# Altium schematic sheet MCU.SchDoc
size B
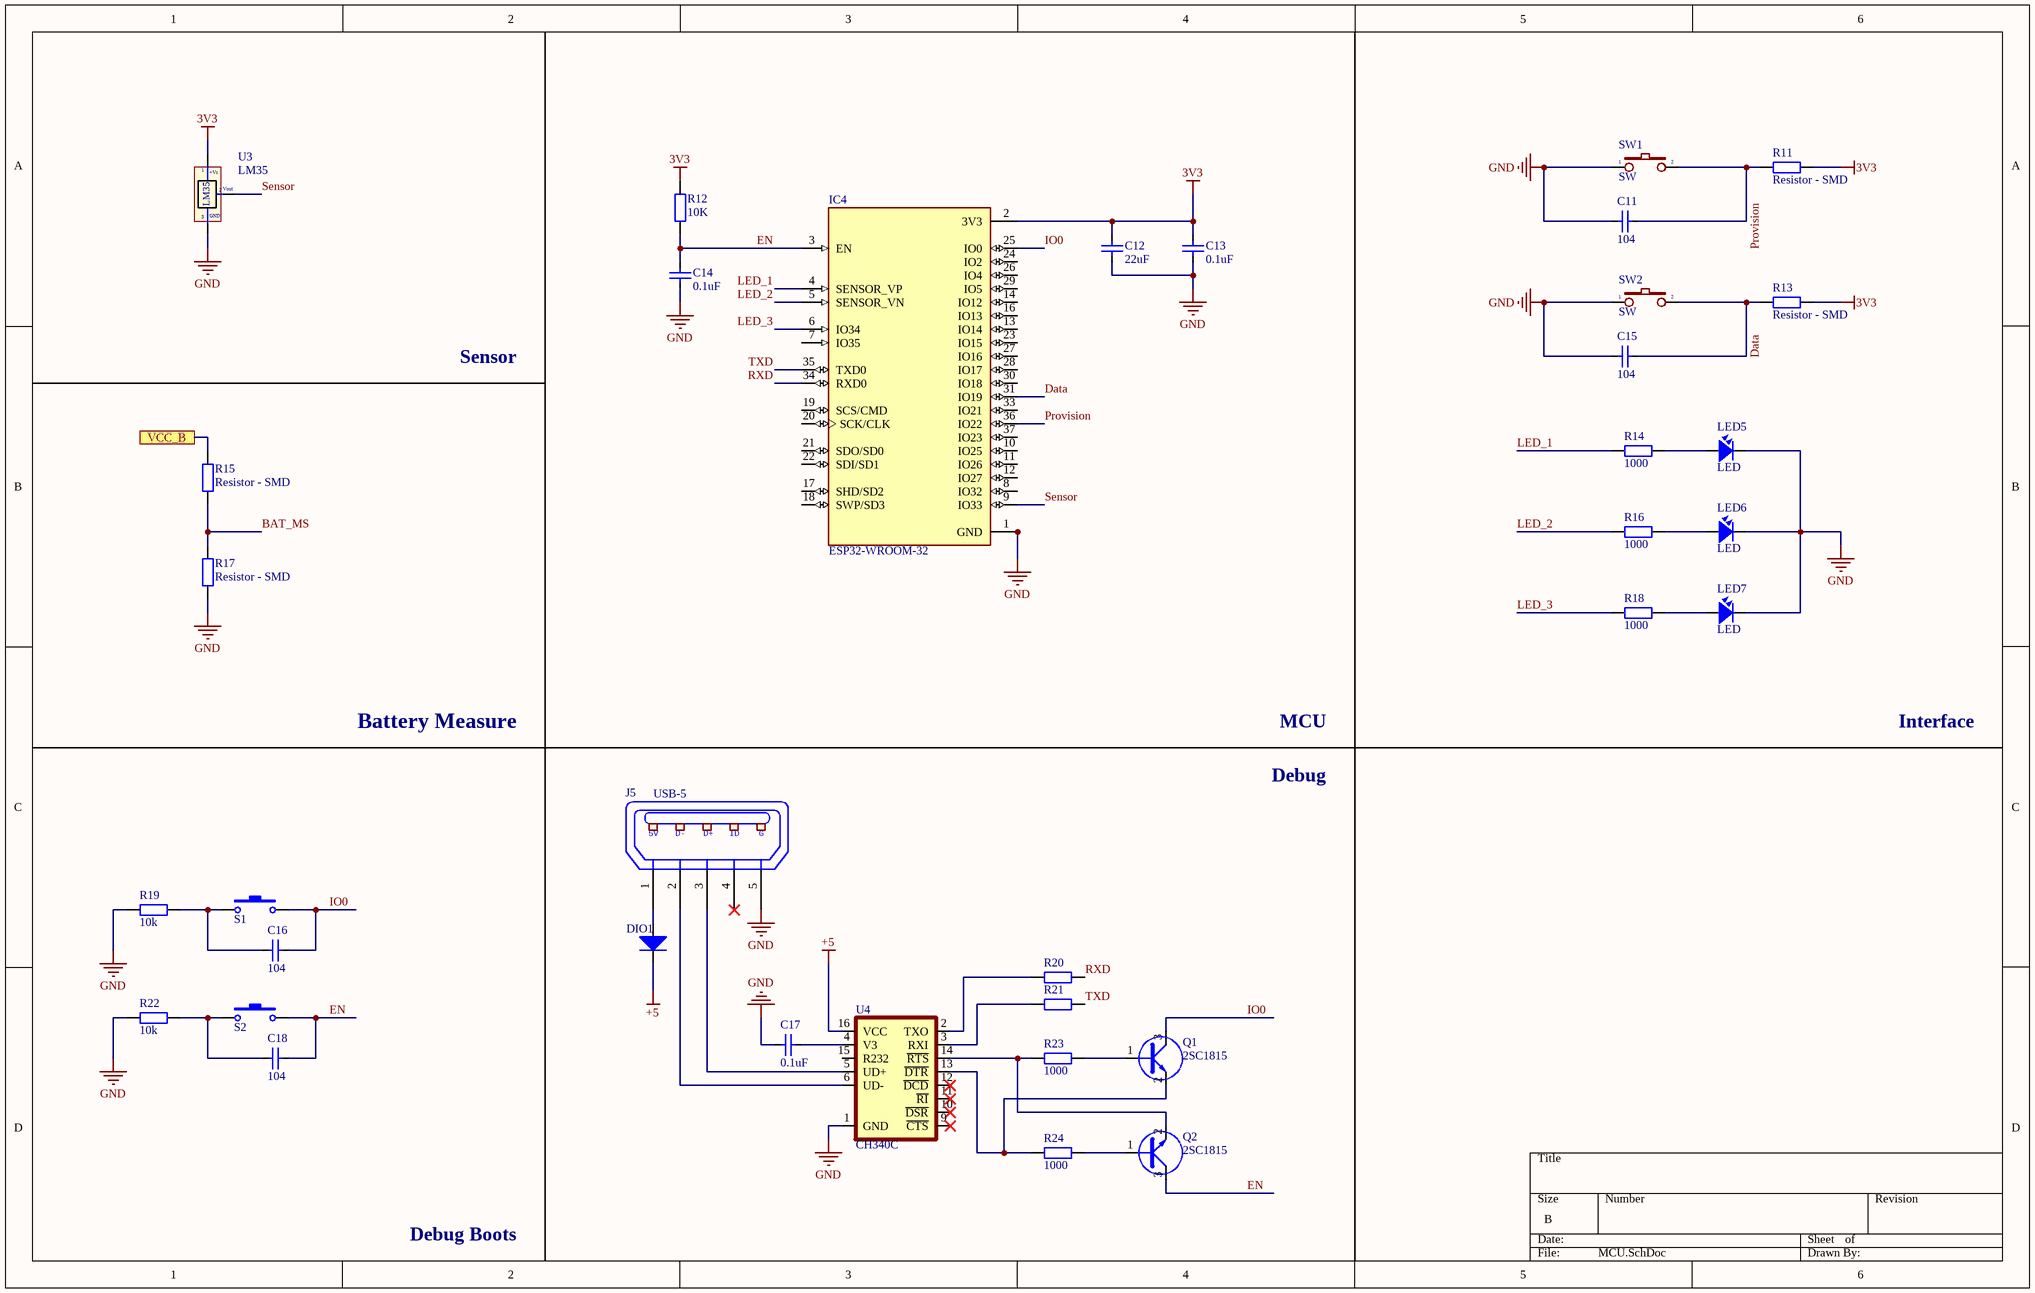
[diagram p0: MCU.SchDoc]

## Parts
C11  104  [CAP_0805]
C12  22uF  [CAP_0805]
C13  0.1uF  [CAP_0805]
C14  0.1uF  [CAP_0805]
C15  104  [CAP_0805]
C16  104  [CAP_0805]
C17  0.1uF  [CAP_0805]
C18  104  [CAP_0805]
DIO1  Diode SMD  [DIO-214AC(SMA)]  (value not drawn)
IC4  ESP32-WROOM-32  [MODULE_ESP32-WROOM-32]
J5  USB-5  [USB-M1]
LED5  LED  [LED-0805-Red]
LED6  LED  [LED-0805-Red]
LED7  LED  [LED-0805-Red]
Q1  2SC1815  [SOT23D]
Q2  2SC1815  [SOT23D]
R11  Resistor - SMD  [RES-SMD-0805]
R12  10K  [RES-SMD-0805]
R13  Resistor - SMD  [RES-SMD-0805]
R14  1000  [RES-SMD-0805]
R15  Resistor - SMD  [RES-SMD-0805]
R16  1000  [RES-SMD-0805]
R17  Resistor - SMD  [RES-SMD-0805]
R18  1000  [RES-SMD-0805]
R19  10k  [RES-SMD-0805]
R20  0R  [RES-SMD-0805]  (value not drawn)
R21  0R  [RES-SMD-0805]  (value not drawn)
R22  10k  [RES-SMD-0805]
R23  1000  [RES-SMD-0805]
R24  1000  [RES-SMD-0805]
S1  SW-SMD  [SW-SMD]  (value not drawn)
S2  SW-SMD  [SW-SMD]  (value not drawn)
SW1  SW  [SW2]
SW2  SW  [SW2]
U3  LM35  [QTO-92]
U4  CH340C  [SOP-16]

## Ports
VCC_B

## Nets
3V3: C12.2 C13.2 IC4.2(3V3) R11.1 R12.1 R13.1 U3.1(+Vs)
+5: DIO1.2(K) U4.16(VCC)
GND: C11.1 C12.1 C13.1 C14.1 C15.1 C17.1 IC4.1(GND) IC4.15(GND) IC4.38(GND) IC4.39_1(GND) IC4.39_2(GND) IC4.39_3(GND) IC4.39_4(GND) IC4.39_5(GND) IC4.39_6(GND) IC4.39_7(GND) IC4.39_8(GND) IC4.39_9(GND) IC4.39_10(GND) IC4.39_11(GND) IC4.39_12(GND) IC4.39_13(GND) IC4.39_14(GND) IC4.39_15(GND) IC4.39_16(GND) IC4.39_17(GND) IC4.39_18(GND) IC4.39_19(GND) IC4.39_20(GND) IC4.39_21(GND) J5.5(P5) LED5.2 LED6.2 LED7.2 R17.2 R19.2 R22.2 SW1.1 SW2.1 U3.3(-) U4.1(GND)
BAT_MS: R15.2 R17.1
Data: C15.2 IC4.31(IO19) R13.2 SW2.2
EN: C14.2 C18.2 IC4.3(EN) Q2.3(C) R12.2 S2.2
IO0: C16.2 IC4.25(IO0) Q1.3(C) S1.2
LED_1: IC4.4(SENSOR_VP) R14.1
LED_2: IC4.5(SENSOR_VN) R16.1
LED_3: IC4.6(IO34) R18.1
Provision: C11.2 IC4.36(IO22) R11.2 SW1.2
RXD: IC4.34(RXD0) R20.1
Sensor: IC4.9(IO33) U3.2(Vout)
TXD: IC4.35(TXD0) R21.1
VCC_B: R15.1 ; port VCC_B
NetC16_1: C16.1 R19.1 S1.1
NetC17_2: C17.2 U4.4(V3)
NetC18_1: C18.1 R22.1 S2.1
NetDIO1_1: DIO1.1(A) J5.1(P1)
NetJ5_2: J5.2(P2) U4.6(UD-)
NetJ5_3: J5.3(P3) U4.5(UD+)
NetLED5_1: LED5.1 R14.2
NetLED6_1: LED6.1 R16.2
NetLED7_1: LED7.1 R18.2
NetQ1_1: Q1.1(B) R23.1
NetQ1_2: Q1.2(E) R24.2 U4.13(~{DTR})
NetQ2_1: Q2.1(B) R24.1
NetQ2_2: Q2.2(E) R23.2 U4.14(~{RTS})
NetR20_2: R20.2 U4.2(TXO)
NetR21_2: R21.2 U4.3(RXI)

Not connected (* = marked no-connect by the designer): IC4 7(IO35) 8(IO32) 10(IO25) 11(IO26) 12(IO27) 13(IO14) 14(IO12) 16(IO13) 17(SHD/SD2) 18(SWP/SD3) 19(SCS/CMD) 20(SCK/CLK) 21(SDO/SD0) 22(SDI/SD1) 23(IO15) 24(IO2) 26(IO4) 27(IO16) 28(IO17) 29(IO5) 30(IO18) 33(IO21) 37(IO23); J5 4(P4)*; U4 9(~{CTS})* 10(~{DSR})* 11(~{RI})* 12(~{DCD})* 15(R232)

## Notes on the sheet
- Sensor
- Battery Measure
- MCU
- Debug
- Interface
- Debug Boots
- (in symbol LM35) GND
- (in symbol USB-5) 5V; D-; D+; ID; G

## Library data of the parts
C11-C18 = CapSMD: Capacitor; Value: 33p; Published: 8-Jun-2000; LatestRevisionDate: 17-Jul-2002; LatestRevisionNote: Re-released for DXP Platform.; PackageReference: RAD-0.3; Publisher: Altium Limited
DIO1 = Diode SMD: Default Diode; Code - JEDEC: DO-214-AB; Value: 1N5007; Published: 8-Jun-2000; Revision: July-2002: Re-released for DXP Platform.; Publisher: Altium Limited
IC4 = ESP32-WROOM-32: Bluetooth, WiFi Transceiver Module 2.4GHz ~ 2.5GHz Surface Mount; MF: Espressif Systems; Package: Module Espressif Systems; Digi-Key_Part_Number: 1904-1010-1-ND; Digi-Key_Purchase_URL: https://www.digikey.com/product-detail/en/espressif-systems/ESP32-WROOM-32/1904-1010-1-ND/8544305?utm_source=snapeda&utm_medium=aggregator&utm_campaign=symbol; Value: *; MP: ESP32-WROOM-32; SnapEDA_Link: https://www.snapeda.com/parts/ESP32-WROOM-32/Espressif%20Systems/view-part/2753322/?ref=snap
J5 = USB-5: Manufacturer: FCI; Manufacturer Part Number: 10118193-0001LF; Connector Type: USB - micro B; Number of Contacts: 5; Gender: Receptacle; Specifications: USB 2.0; .Creator: MM; .Checked PCB: RF; Supplier 1: Digi-Key; RoHS: RoHS Compliant; Category: Connectors, Interconnects; Stock 1: 28642; Pricing 1: 1=0.46, 10=0.433, 25=0.3712, 50=0.3156, 100=0.3032, 250=0.27224, 500=0.25988 (USD); Packaging: Cut Tape (CT); Mounting Type: Surface Mount, Right Angle, Horizontal; Features: Shielded, Solder Retention; Ingress Protection: -; ComponentLink1URL: http://portal.fciconnect.com/Comergent//fci/drawing/10118193.pdf; ComponentLink1Description: http://portal.fciconnect.com/Comergent//fci/drawing/10118193.pdf; Supplier Part Number 1: 609-4616-1-ND; .Checked SCH: MM
LED5-LED7 = LED: LED Single colour Green and Red; Value: LED 3 ly Single Colour
Q1 Q2 = C1815: NPN 600mW, ECB; Value: C1815
R11-R24 = Resistor - SMD: Resistor SMD; Manufacturer: Generic Components; Class: Passive; Published: 08/06/2000; Publisher: Altium Hobart Technology Centre
S1 S2 = SW-SMD: Switch; Published: 24-Mar-1999; LatestRevisionDate: 17-Jul-2002; LatestRevisionNote: Re-released for DXP Platform.; PackageReference: SPST-2; Publisher: Altium Limited
SW1 SW2 = SW2: Switch button 2 pin; Value: SW chip 2 pin
U3 = LM35: Teminal; Value: LM35
U4 = CH340C: USB to serial chip CH340; MF: WCH; Package: Package; Check_prices: https://www.snapeda.com/parts/CH340C/WCH/view-part/5428851/?ref=eda; Value: *; Price: None; MP: CH340C; Availability: Unavailable; SnapEDA_Link: https://www.snapeda.com/parts/CH340C/WCH/view-part/5428851/?ref=snap